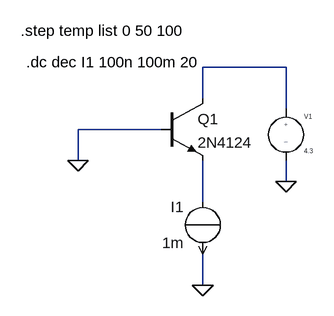
[diagram p0: schematic beta-kennlininie3.asc]
beta-kennlininie3.asc, the LTspice schematic file:
Version 4
SHEET 1 880 680
WIRE 416 80 288 80
WIRE 288 128 288 80
WIRE 416 144 416 80
WIRE 224 176 96 176
WIRE 96 224 96 176
WIRE 416 256 416 224
WIRE 288 288 288 224
WIRE 288 416 288 368
FLAG 288 416 0
FLAG 416 256 0
FLAG 96 224 0
SYMBOL EIT_Semiconductors\\npn 224 128 R0
SYMATTR InstName Q1
SYMATTR Value 2N4124
SYMBOL source-V 416 128 R0
SYMATTR InstName V1
SYMATTR Value 4.3
SYMBOL source-I 288 368 R180
WINDOW 0 29 73 Left 2
WINDOW 3 29 17 Left 2
SYMATTR InstName I1
SYMATTR Value 1m
TEXT 16 72 Left 2 !.dc dec I1 100n 100m 20
TEXT 8 24 Left 2 !.step temp list 0 50 100

The netlist it stands for:
* beta-kennlininie3.asc
Q1 N001 0 N002 0 2N4124
V1 N001 0 4.3
I1 N002 0 1m
.model NPN NPN
.model PNP PNP
.lib standard.bjt
.dc dec I1 100n 100m 20
.step temp list 0 50 100
.backanno
.end